# Altium schematic sheet MD5133-A01-02.schdoc
size B; SheetNumber: 0; SheetTotal: 0; PageSetup: Record=PageOptions|CenterHorizontal=True|CenterVertical=True|PrintScale=0.75|XCorrection=1.00|YCorrection=1.00|PrintKind=0|BorderSize=5000000|LeftOffset=0|BottomOffset=0|Orientation=2|PaperLength=1000|PaperWidth=1000|Scale=100|PaperSource=7|PrintQuality=-4|MediaType=1|DitherType=10|PaperKind=A4|PrintScaleMode=1
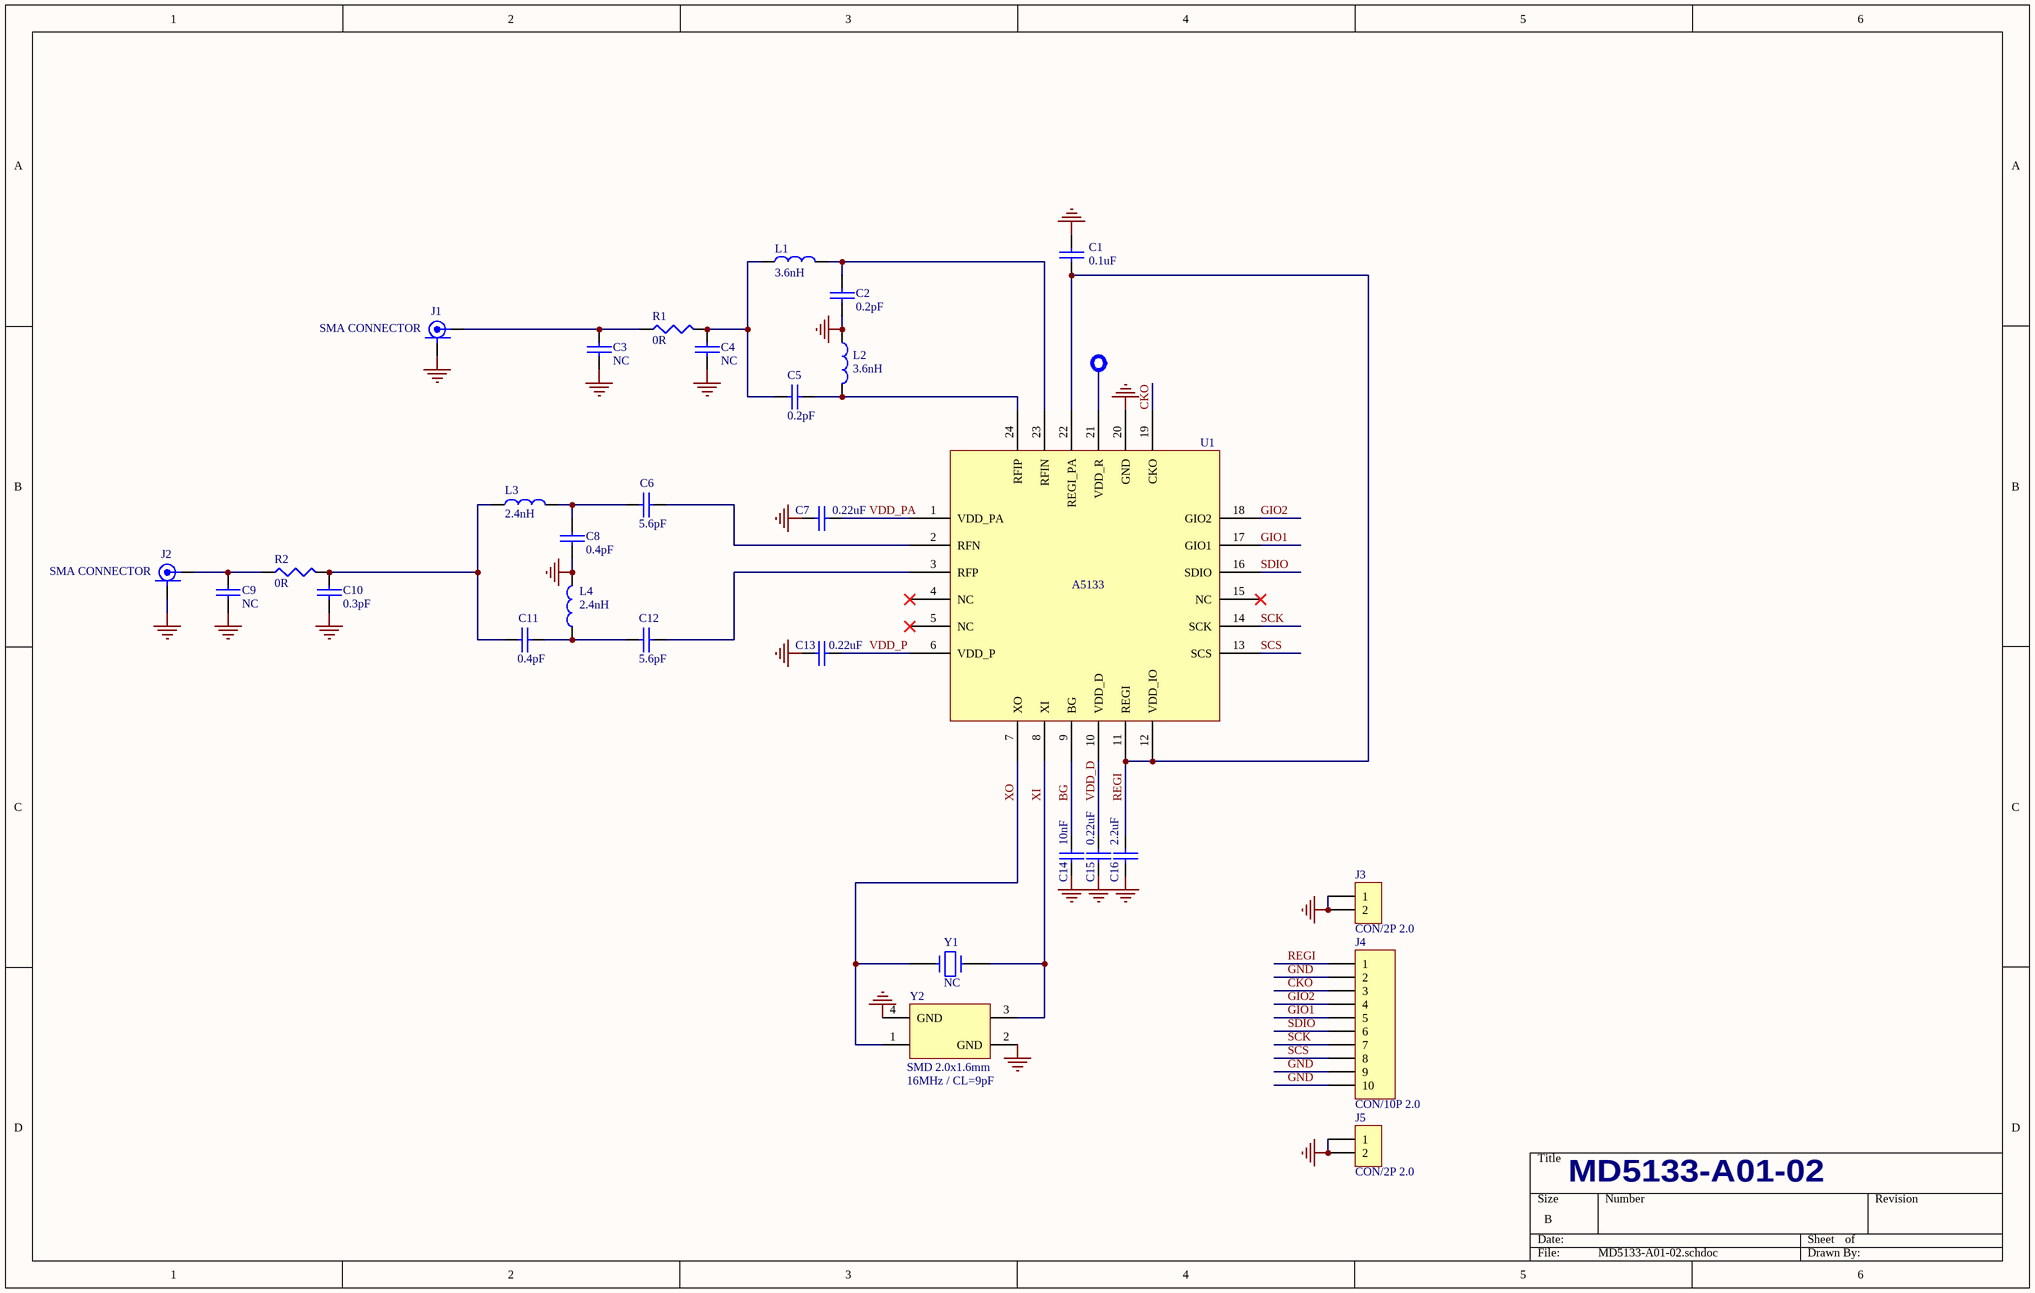
[diagram p0: MD5133-A01-02.schdoc]

## Parts
C1  0.1uF  [0402]
C2  0.2pF  [0402]
C3  NC  [0402]
C4  NC  [0402]
C5  0.2pF  [0402]
C6  5.6pF  [0402]
C7  0.22uF  [0402]
C8  0.4pF  [0402]
C9  NC  [0402]
C10  0.3pF  [0402]
C11  0.4pF  [0402]
C12  5.6pF  [0402]
C13  0.22uF  [0402]
C14  10nF  [0402]
C15  0.22uF  [0402]
C16  2.2uF  [0402]
J1  SMA CONNECTOR  [SMA CONNECTOR]
J2  SMA CONNECTOR  [SMA CONNECTOR]
J3  CON/2P 2.0  [HDR2_2.0]
J4  CON/10P 2.0  [HDR10_2.0]
J5  CON/2P 2.0  [HDR2_2.0]
L1  3.6nH  [0402]
L2  3.6nH  [0402]
L3  2.4nH  [0402]
L4  2.4nH  [0402]
R1  0R  [0402]
R2  0R  [0402]
U1  A5133-U01  [QFN 4*4 24L_A7190]  (value not drawn)
Y1  NC  [XTAL1]
Y2  SMD 2.0x1.6mm  [XTAL_2.0 *1.6]

## Nets
GND: C1.2 C2.1 C3.1 C4.1 C7.1 C8.2 C9.2 C10.2 C13.1 C14.2 C15.2 C16.2 J1.0(SHIELD) J2.0(SHIELD) J3.1 J3.2 J4.2 J4.9 J4.10 J5.1 J5.2 L2.1 L4.2 U1.20(GND) Y2.2(GND) Y2.4(GND)
BG: C14.1 U1.9(BG)
CKO: J4.3 U1.19(CKO)
GIO1: J4.5 U1.17(GIO1)
GIO2: J4.4 U1.18(GIO2)
REGI: C1.1 C16.1 J4.1 U1.11(REGI) U1.12(VDD_IO) U1.22(REGI_PA)
SCK: J4.7 U1.14(SCK)
SCS: J4.8 U1.13(SCS)
SDIO: J4.6 U1.16(SDIO)
VDD_D: C15.1 U1.10(VDD_D)
VDD_P: C13.2 U1.6(VDD_P)
VDD_PA: C7.2 U1.1(VDD_PA)
XI: U1.8(XI) Y1.2 Y2.3
XO: U1.7(XO) Y1.1 Y2.1
NetC2_2: C2.2 L1.2 U1.23(RFIN)
NetC3_2: C3.2 J1.1(CENTER_1) R1.1
NetC4_2: C4.2 C5.1 L1.1 R1.2
NetC5_2: C5.2 L2.2 U1.24(RFIP)
NetC6_1: C6.1 C8.1 L3.1
NetC6_2: C6.2 U1.2(RFN)
NetC9_1: C9.1 J2.1(CENTER_1) R2.1
NetC10_1: C10.1 C11.2 L3.2 R2.2
NetC11_1: C11.1 C12.1 L4.1
NetC12_2: C12.2 U1.3(RFP)

Not connected (* = marked no-connect by the designer): U1 4(NC)* 5(NC)* 15(NC)* 21(VDD_R)

## Notes on the sheet
- (near Y2) 16MHz / CL=9pF
- MD5133-A01-02
- (in symbol A5133_U01) A5133

## Library data of the parts
C1 C7 C13-C16 = CAP
C2-C6 C8-C12 = C/0603: Chip C
J3 J5 = CON/2P 2.0: Hole 36mil
J4 = CON/10P 2.0: Hole 36mil
L1-L4 = L/0603
R1 R2 = R/0402: Chip R
U1 = A5133_U01
Y1 = CRYSTAL: 16MHz
Y2 = CRYSTAL/5*3.2: (TST)16MHz,Cl=9pF